# Altium schematic sheet sb-sonata-usbrp.SchDoc: RP2040 Controller
size Letter; Organization: NewAE Technology Inc.; Address1: 1083 Queen St., Suite 196; Address2: Halifax; Address3: NS; Address4: Canada B3H 0B2; SheetNumber: 5; SheetTotal: 22; SheetApproved: YES
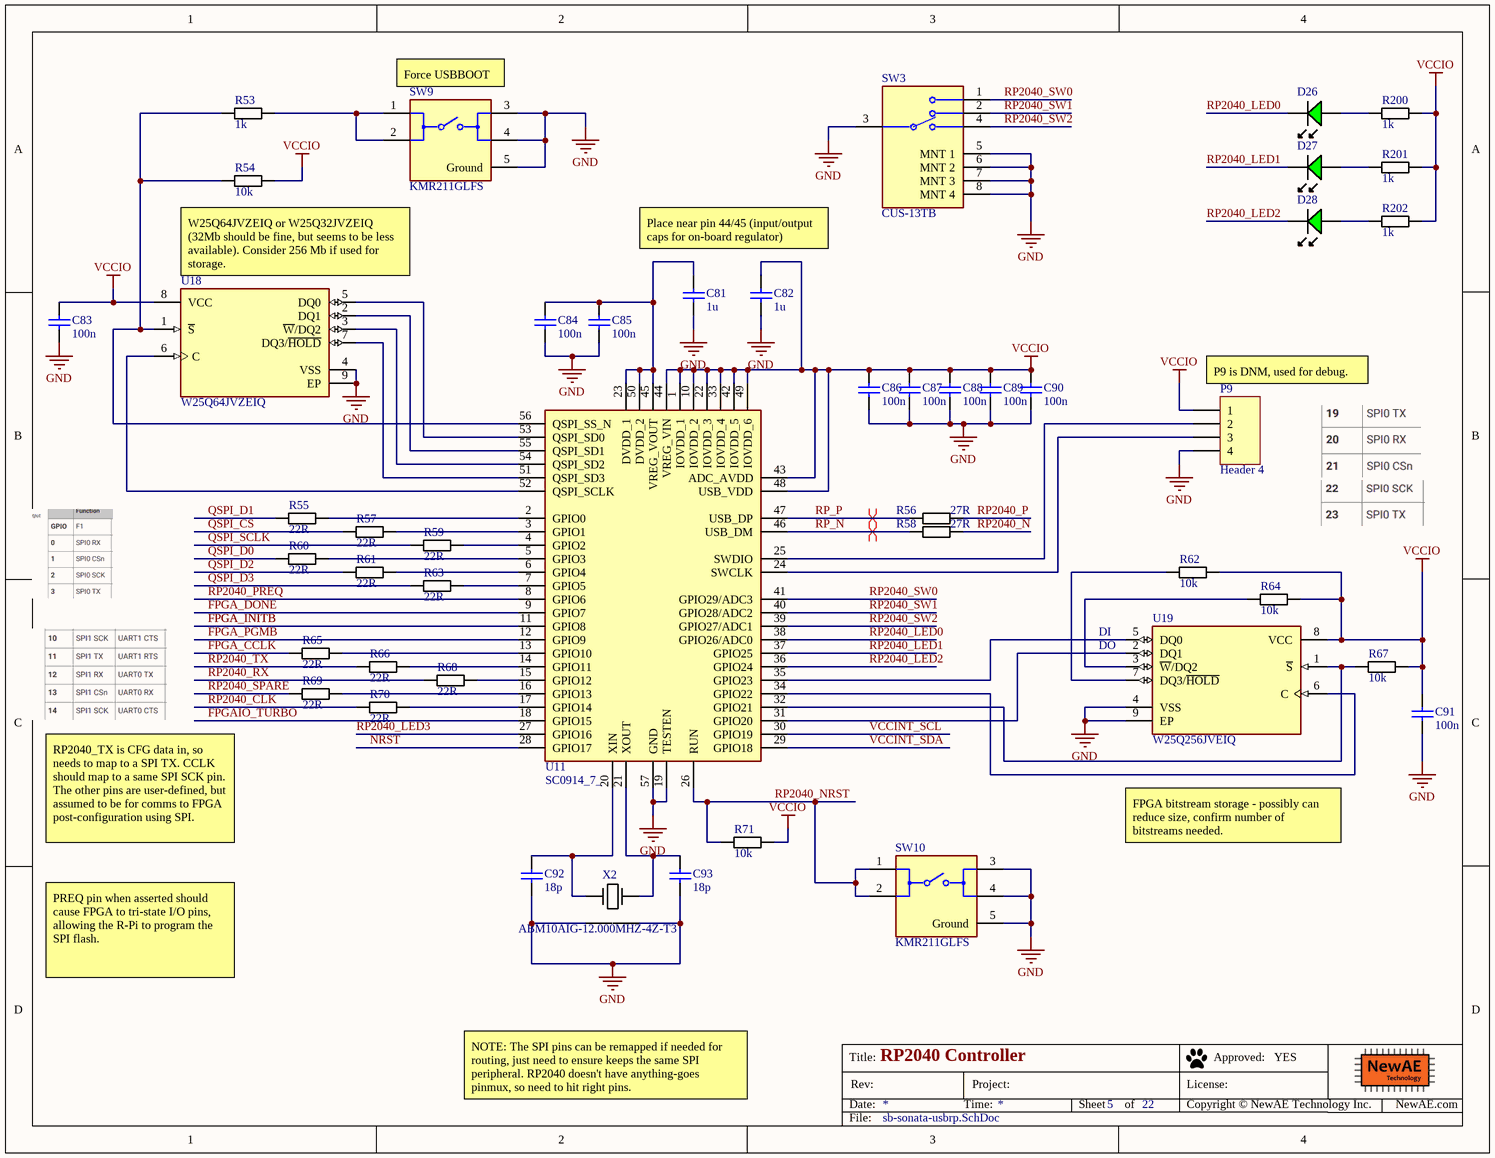
[diagram p0: sb-sonata-usbrp.SchDoc]

## Parts
C81  1u  [CAPC0603_M]
C82  1u  [CAPC0603_M]
C83  100n  [CAPC0402_M]
C84  100n  [CAPC0402_M]
C85  100n  [CAPC0402_M]
C86  100n  [CAPC0402_M]
C87  100n  [CAPC0402_M]
C88  100n  [CAPC0402_M]
C89  100n  [CAPC0402_M]
C90  100n  [CAPC0402_M]
C91  100n  [CAPC0402_M]
C92  18p  [CAPC0402_M]
C93  18p  [CAPC0402_M]
D26  LED, 0603, Green  [LED-0603-GREEN]  (value not drawn)
D27  LED, 0603, Green  [LED-0603-GREEN]  (value not drawn)
D28  LED, 0603, Green  [LED-0603-GREEN]  (value not drawn)
P9  Header 4  [HDR1X4]
R53  1k  [RESC1005X40N]
R54  10k  [RESC1005X40N]
R55  22R  [RESC1005X40N]
R56  27R  [RESC1005X40N]
R57  22R  [RESC1005X40N]
R58  27R  [RESC1005X40N]
R59  22R  [RESC1005X40N]
R60  22R  [RESC1005X40N]
R61  22R  [RESC1005X40N]
R62  10k  [RESC1005X40N]
R63  22R  [RESC1005X40N]
R64  10k  [RESC1005X40N]
R65  22R  [RESC1005X40N]
R66  22R  [RESC1005X40N]
R67  10k  [RESC1005X40N]
R68  22R  [RESC1005X40N]
R69  22R  [RESC1005X40N]
R70  22R  [RESC1005X40N]
R71  10k  [RESC1005X40N]
R200  1k  [RESC1005X40N]
R201  1k  [RESC1005X40N]
R202  1k  [RESC1005X40N]
SW3  CUS-13TB  [FP-CUS-13TB-MFG]
SW9  KMR211GLFS  [FP-KMR211GLFS-MFG]
SW10  KMR211GLFS  [FP-KMR211GLFS-MFG]
U11  SC0914_7_  [QFN40P700X700X90-57N-D]
U18  W25Q64JVZEIQ  [WSON68_Micron]
U19  W25Q256JVEIQ  [WSON68_Micron]
X2  ABM10AIG-12.000MHZ-4Z-T3  [2.5x2mm XTAL]

## Nets
GND: C81.2 C82.2 C83.2 C84.2 C85.2 C86.2 C87.2 C88.2 C89.2 C90.2 C91.2 C92.2 C93.2 P9.4 SW3.3(C) SW3.5(MNT_1) SW3.6(MNT_2) SW3.7(MNT_3) SW3.8(MNT_4) SW9.3 SW9.4 SW9.5(Ground) SW10.3 SW10.4 SW10.5(Ground) U11.19(TESTEN) U11.57(GND) U18.4(VSS) U18.9(EP) U19.4(VSS) U19.9(EP) X2.2(GND) X2.4(GND)
VCCIO: C82.1 C83.1 C86.1 C87.1 C88.1 C89.1 C90.1 C91.1 P9.1 R54.1 R62.1 R64.1 R67.2 R71.2 R200.2 R201.2 R202.2 U11.1(IOVDD_1) U11.10(IOVDD_2) U11.22(IOVDD_3) U11.33(IOVDD_4) U11.42(IOVDD_5) U11.43(ADC_AVDD) U11.44(VREG_VIN) U11.48(USB_VDD) U11.49(IOVDD_6) U18.8(VCC) U19.8(VCC)
FPGA_CCLK: R65.1
FPGA_DONE: U11.9(GPIO7)
FPGA_INITB: U11.11(GPIO8)
FPGA_PGMB: U11.12(GPIO9)
FPGAIO_TURBO: U11.18(GPIO15)
NRST: U11.28(GPIO17)
QSPI_CS: R57.1
QSPI_D0: R60.1
QSPI_D1: R55.1
QSPI_D2: R61.1
QSPI_D3: R63.1
QSPI_SCLK: R59.1
RP2040_CLK: R70.1
RP2040_LED0: D26.K U11.38(GPIO26/ADC0)
RP2040_LED1: D27.K U11.37(GPIO25)
RP2040_LED2: D28.K U11.36(GPIO24)
RP2040_LED3: U11.27(GPIO16)
RP2040_N: R58.1
RP2040_NRST: R71.1 SW10.1 SW10.2 U11.26(RUN)
RP2040_P: R56.1
RP2040_PREQ: U11.8(GPIO6)
RP2040_RX: R68.1
RP2040_SPARE: R69.1
RP2040_SW0: SW3.1 U11.41(GPIO29/ADC3)
RP2040_SW1: SW3.2 U11.40(GPIO28/ADC2)
RP2040_SW2: SW3.4 U11.39(GPIO27/ADC1)
RP2040_TX: R66.1
RP_N: R58.2 U11.46(USB_DM)
RP_P: R56.2 U11.47(USB_DP)
VCCINT_SCL: U11.30(GPIO19)
VCCINT_SDA: U11.29(GPIO18)
NetC81_1: C81.1 C84.1 C85.1 U11.23(DVDD_1) U11.45(VREG_VOUT) U11.50(DVDD_2)
NetC92_1: C92.1 U11.20(XIN) X2.1(IN)
NetC93_1: C93.1 U11.21(XOUT) X2.3(OUT)
NetD26_A: D26.A R200.1
NetD27_A: D27.A R201.1
NetD28_A: D28.A R202.1
NetP9_2: P9.2 U11.25(SWDIO)
NetP9_3: P9.3 U11.24(SWCLK)
NetR53_1: R53.1 R54.2 U11.56(QSPI_SS_N) U18.1(~{S})
NetR53_2: R53.2 SW9.1 SW9.2
NetR55_2: R55.2 U11.2(GPIO0)
NetR57_2: R57.2 U11.3(GPIO1)
NetR59_2: R59.2 U11.4(GPIO2)
NetR60_2: R60.2 U11.5(GPIO3)
NetR61_2: R61.2 U11.6(GPIO4)
NetR62_2: R62.2 U19.7(DQ3/~{HOLD})
NetR63_2: R63.2 U11.7(GPIO5)
NetR64_2: R64.2 U19.3(~{W}/DQ2)
NetR65_2: R65.2 U11.13(GPIO10)
NetR66_2: R66.2 U11.14(GPIO11)
NetR67_1: R67.1 U11.32(GPIO21) U19.1(~{S})
NetR68_2: R68.2 U11.15(GPIO12)
NetR69_2: R69.2 U11.16(GPIO13)
NetR70_2: R70.2 U11.17(GPIO14)
NetU11_31: U11.31(GPIO20) U19.2(DQ1)
NetU11_34: U11.34(GPIO22) U19.6(C)
NetU11_35: U11.35(GPIO23) U19.5(DQ0)
NetU11_51: U11.51(QSPI_SD3) U18.7(DQ3/~{HOLD})
NetU11_52: U11.52(QSPI_SCLK) U18.6(C)
NetU11_53: U11.53(QSPI_SD0) U18.5(DQ0)
NetU11_54: U11.54(QSPI_SD2) U18.3(~{W}/DQ2)
NetU11_55: U11.55(QSPI_SD1) U18.2(DQ1)

## Layout directives
differential pair; differential pair class USB_DIFF_PAIR: RP_N, RP_P

## Notes on the sheet
- (near SW9) Force USBBOOT
- W25Q64JVZEIQ or W25Q32JVZEIQ (32Mb should be fine, but seems to be less available). Consider 256 Mb if used for storage.
- Place near pin 44/45 (input/output caps for on-board regulator)
- (near P9) P9 is DNM, used for debug.
- (near U19) DI
- (near U19) DO
- RP2040_TX is CFG data in, so needs to map to a SPI TX. CCLK should map to a same SPI SCK pin. The other pins are user-defined, but assumed to be for comms to FPGA post-configuration using SPI.
- FPGA bitstream storage - possibly can reduce size, confirm number of bitstreams needed.
- PREQ pin when asserted should cause FPGA to tri-state I/O pins, allowing the R-Pi to program the SPI flash.
- NOTE: The SPI pins can be remapped if needed for routing, just need to ensure keeps the same SPI peripheral. RP2040 doesn't have anything-goes pinmux, so need to hit right pins.
- Title:
- Date:
- Rev:
- Time:
- Project:
- Sheet
- of
- License:
- Copyright © NewAE Technology Inc.
- Approved:
- NewAE.com
- File:

## Library data of the parts
C81 C82 = CCHIP-1u-0603: 1u, 0603, 50V; Manufacture Part Number 1: CL10A105KB8NNNC; Component Group: Capacitor; Case-EIA: 0603; Case-Metric: 1608; Rated Voltage: 50VDC; Part Number: CCHIP-1u-0603; Footprint: 0603; Pin Count: 2; Supplier 1: Digi-Key; Supplier Part Number 1: 1276-1860-1-ND; Value: 1u; Mounting Technology: SMT; Component Kind: Standard; Component Type: Standard
C83-C91 = CCHIP-100n-0402: 100n, 0402; Manufacture Part Number 1: CGA2B3X7R1V104K050BB; Component Group: Capacitor; Case-EIA: 0402; Part Number: CCHIP-100n-0402; Footprint: 0402; Pin Count: 2; Supplier 1: Digi-Key; Supplier Part Number 1: 445-6901-1-ND; Value: 100n; Mounting Technology: SMT; Component Kind: Standard; Component Type: Standard
C92 C93 = CCHIP-18p-0402: 18p, 0402; Manufacture Part Number 1: GRM1555C1H180JA01D; Component Group: Capacitor; Case-EIA: 0402; Part Number: CCHIP-18p-0402; Footprint: 0402; Pin Count: 2; Supplier 1: Digi-Key; Supplier Part Number 1: 490-5858-1-ND; Value: 18p; Mounting Technology: SMT; Component Kind: Standard; Component Type: Standard
D26-D28 = LEDCHIP_0603_GREEN: Chip LED, Green; Manufacture 1: Kingbright; Manufacture Part Number 1: APT1608CGCK; Component Group: Optical; PP Material Stack: 16; PP Rotation: -90; Part Number: LEDCHIP_0603_GREEN; Pin Count: 2; Supplier 1: Digi-Key; Supplier Part Number 1: 754-1116-1-ND; Mounting Technology: SMT; Component Kind: Standard; Component Type: Standard
P9 = Header 4: Header, 4-Pin; LatestRevisionDate: 17-Jul-2002; LatestRevisionNote: Re-released for DXP Platform.; Publisher: Altium Limited
R53 R200-R202 = RCHIP-1K-0402: 1k res, 0402, 1%, 1/16W; Manufacture 1: Yageo; Manufacture Part Number 1: RC0402FR-071KL; Component Group: Resistor; Case-EIA: 0402; Case-Metric: 1005; Rated Power: 0.063W; Rated Voltage: 75VDC; Part Number: RCHIP-1K-0402; Footprint: 0402; Pin Count: 2; Supplier 1: Digi-Key; Supplier Part Number 1: 311-1.00KLRCT-ND; Value: 1k; Tolerance: 1%; Mounting Technology: SMT; Temperature Range: -55C to 155C; Component Kind: Standard; Component Type: Standard
R54 R62 R64 R67 R71 = RCHIP-10K-0402: 10k res, 0402, 1%, 1/16W; Manufacture 1: Yageo; Manufacture Part Number 1: RC0402FR-0710KL; Component Group: Resistor; Case-EIA: 0402; Case-Metric: 1005; Rated Power: 0.063W; Rated Voltage: 75VDC; Part Number: RCHIP-10K-0402; Footprint: 0402; Pin Count: 2; Supplier 1: Digi-Key; Supplier Part Number 1: 311-10.0KLRCT-ND; Value: 10k; Tolerance: 1%; Mounting Technology: SMT; Temperature Range: -55C to 155C; Component Kind: Standard; Component Type: Standard
R55 R57 R59-R61 R63 R65 R66 R68-R70 = RCHIP-22R-0402: 22R res, 0402, 1%, 1/16W; Manufacture 1: Yageo; Manufacture Part Number 1: RC0402FR-0722RL; Component Group: Resistor; Case-EIA: 0402; Case-Metric: 1005; Rated Power: 0.063W; Rated Voltage: 75VDC; Part Number: RCHIP-22R-0402; Footprint: 0402; Pin Count: 2; Supplier 1: Digi-Key; Supplier Part Number 1: 311-22.0LRCT-ND; Value: 22R; Tolerance: 1%; Mounting Technology: SMT; Temperature Range: -55C to 155C; Component Kind: Standard; Component Type: Standard
R56 R58 = RCHIP-27R-0402: 27R res, 0402, 1%, 1/16W; Manufacture 1: Yageo; Manufacture Part Number 1: RC0402FR-0727RL; Component Group: Resistor; Case-EIA: 0402; Case-Metric: 1005; Rated Power: 0.063W; Rated Voltage: 75VDC; Part Number: RCHIP-27R-0402; Footprint: 0402; Pin Count: 2; Supplier 1: Digi-Key; Supplier Part Number 1: YAG3086CT-ND; Value: 27R; Tolerance: 1%; Mounting Technology: SMT; Temperature Range: -55C to 155C; Component Kind: Standard; Component Type: Standard
SW3 = CMP-71745-000014-1: SWITCH SLIDE SP3T 300MA 4V; Actuator Length: 1.5mm; Electrical Life: 10000Cycles; Max Voltage Rating (DC): 20V; Switch Function: On-On-On; Actuator Material: Nylon; Actuator Type: Standard; Contact Style: Non-Shorting; Contact Plating: Gold; Termination: Gull Wing; Radiation Hardening: No; Series: CUS; Max Operating Temperature: 70°C; Mount: Surface Mount; Switch Travel: 1.5mm; Packaging: Tape and Reel; Min Operating Temperature: -20°C; Contact Material: Copper Alloy; Orientation: Right Angle; Voltage Rating (DC): 4V; RoHS Compliant: Yes; Current Rating: 300mA; Throw Configuration: SP3T
SW9 SW10 = CMP-10040-000023-1: SWITCH TACTILE SPST-NO 0.05A 32V; Switch Function: Off-Mom; Throw Configuration: SPST; Switch Travel: 0.2mm; Current Rating: 50mA; Illumination Type: Non-Illuminated; Actuator Length: 0.5mm; Power Rating: 1W; Operating Force: 1.2N; Actuator Type: Standard; Mechanical Life: 200000Cycles; REACH SVHC: No SVHC; Voltage Rating (DC): 32V; Length: 2.8mm; Min Operating Temperature: -40°C; Mount: Surface Mount; Max Voltage Rating (DC): 32V; Width: 2.8mm; Depth: 4.6mm; Packaging: Tape and Reel; Lead Free: Lead Free; Contact Material: Silver; Termination: Gull Wing; Package Quantity: 1; Contact Current Rating: 50mA; Orientation: Straight; Max Operating Temperature: 85°C; Radiation Hardening: No; Max Current Rating: 50mA; Contact Plating: Silver
U11 = SC0914_7_: Connector; Manufacturer_Name: RASPBERRY-PI; Manufacturer_Part_Number: SC0914(7); Datasheet Link: https://www.mouser.com/datasheet/2/635/rp2040_datasheet-3048960.pdf; Height: 0.9mm; Mouser Part Number: 358-SC09147; Mouser Price/Stock: https://www.mouser.co.uk/ProductDetail/Raspberry-Pi/SC09147?qs=T%252BzbugeAwjhSpdbCB4ve%252Bg%3D%3D
U18 = MT25QL256ABA1EW9-0SIT: IC FLASH 64M SPI 133MHZ 8WPDFN; Manufacture 1: Winbond; Component Group: Digital IC; PP Material Stack: 0; Part Number: W25Q64JVZEIQ; Footprint: WSON-8x6; Manufacture Part Number 1: W25Q64JVZEIQ; Pin Count: 9; Supplier 1: Digi-Key; Mounting Technology: SMT; RoHS: Yes; Component Kind: Standard; Component Type: Standard; PP Rotation: 0; PP Rotation1: 0
U19 = MT25QL256ABA1EW9-0SIT: IC FLASH 256M SPI 133MHZ 8WPDFN; Manufacture 1: Winbond; Component Group: Digital IC; PP Material Stack: 0; Part Number: W25Q256JVEIQ; Footprint: WSON-8x6; Manufacture Part Number 1: W25Q256JVEIQ; Pin Count: 9; Supplier 1: Digi-Key; Mounting Technology: SMT; RoHS: Yes; Component Kind: Standard; Component Type: Standard; PP Rotation: 0; PP Rotation1: 0
X2 = ABM10AIG-12.000MHZ-4Z-T3: 12MHz, SMD; Manufacture 1: Abracon LLC; Component Group: Crystal; PP Material Stack: 0; Part Number: ABM10AIG-12.000MHZ-4Z-T3; Manufacture Part Number 1: ABM10AIG-12.000MHZ-4Z-T3; Pin Count: 4; Supplier 1: Digi-Key; Supplier Part Number 1: 535-13360-1-ND; Value: 12.000MHz; Mounting Technology: SMT; Component Kind: Standard; Component Type: Standard; PP Rotation: 0